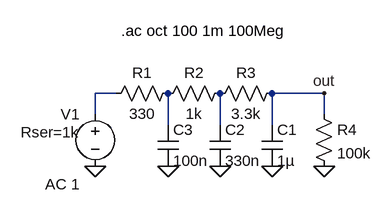
[diagram p0: schematic gpsdo_lowpass.asc]
gpsdo_lowpass.asc, the LTspice schematic file:
Version 4
SHEET 1 880 680
WIRE 80 112 48 112
WIRE 400 112 320 112
WIRE 48 144 48 112
WIRE 400 144 400 112
WIRE 160 160 160 112
WIRE 240 160 240 112
WIRE 320 160 320 112
FLAG 160 224 0
FLAG 240 224 0
FLAG 320 224 0
FLAG 48 224 0
FLAG 400 224 0
FLAG 400 112 out
SYMBOL cap 304 160 R0
SYMATTR InstName C1
SYMATTR Value 1µ
SYMBOL cap 224 160 R0
SYMATTR InstName C2
SYMATTR Value 330n
SYMBOL cap 144 160 R0
SYMATTR InstName C3
SYMATTR Value 100n
SYMBOL res 176 96 R90
WINDOW 0 0 56 VBottom 2
WINDOW 3 32 56 VTop 2
SYMATTR InstName R1
SYMATTR Value 330
SYMBOL res 256 96 R90
WINDOW 0 0 56 VBottom 2
WINDOW 3 32 56 VTop 2
SYMATTR InstName R2
SYMATTR Value 1k
SYMBOL res 336 96 R90
WINDOW 0 0 56 VBottom 2
WINDOW 3 32 56 VTop 2
SYMATTR InstName R3
SYMATTR Value 3.3k
SYMBOL res 384 128 R0
SYMATTR InstName R4
SYMATTR Value 100k
SYMBOL voltage 48 128 M0
WINDOW 123 24 124 Left 2
WINDOW 39 24 44 Left 2
SYMATTR Value2 AC 1
SYMATTR SpiceLine Rser=1k
SYMATTR InstName V1
SYMATTR Value ""
TEXT 88 16 Left 2 !.ac oct 100 1m 100Meg

The netlist it stands for:
* gpsdo_lowpass.asc
C1 out 0 1µ
C2 N003 0 330n
C3 N002 0 100n
R1 N002 N001 330
R2 N003 N002 1k
R3 out N003 3.3k
R4 out 0 100k
V1 N001 0 AC 1 Rser=1k
.ac oct 100 1m 100Meg
.backanno
.end